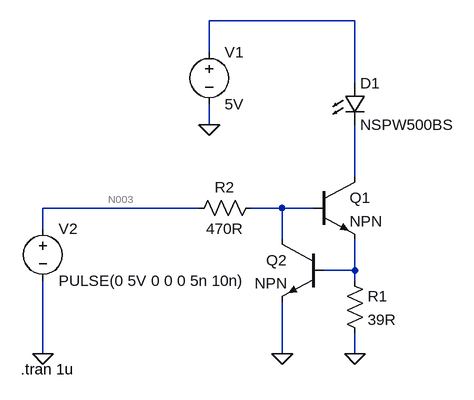
[diagram p0: schematic modulated_current_source.asc]
modulated_current_source.asc, the LTspice schematic file:
Version 4
SHEET 1 880 680
WIRE 368 -208 144 -208
WIRE 144 -160 144 -208
WIRE 368 -112 368 -208
WIRE 144 -48 144 -80
WIRE 368 32 368 -48
WIRE 128 80 -112 80
WIRE 256 80 208 80
WIRE 304 80 256 80
WIRE -112 112 -112 80
WIRE 256 128 256 80
WIRE 368 176 368 128
WIRE 368 176 320 176
WIRE 368 192 368 176
WIRE -112 304 -112 192
WIRE 256 304 256 224
WIRE 368 304 368 272
FLAG 368 304 0
FLAG 256 304 0
FLAG -112 304 0
FLAG 144 -48 0
SYMBOL npn 304 32 R0
SYMATTR InstName Q1
SYMBOL npn 320 128 M0
SYMATTR InstName Q2
SYMBOL res 352 176 R0
SYMATTR InstName R1
SYMATTR Value 39R
SYMBOL LED 352 -112 R0
SYMATTR InstName D1
SYMATTR Value NSPW500BS
SYMBOL voltage 144 -176 R0
WINDOW 123 0 0 Left 2
WINDOW 39 0 0 Left 2
SYMATTR InstName V1
SYMATTR Value 5V
SYMBOL voltage -112 96 R0
WINDOW 123 0 0 Left 2
WINDOW 39 0 0 Left 2
SYMATTR InstName V2
SYMATTR Value PULSE(0 5V 0 0 0 5n 10n)
SYMBOL res 112 96 R270
WINDOW 0 32 56 VTop 2
WINDOW 3 0 56 VBottom 2
SYMATTR InstName R2
SYMATTR Value 470R
TEXT -146 328 Left 2 !.tran 1u

The netlist it stands for:
* modulated_current_source.asc
Q1 N002 N004 N005 0 NPN
Q2 N004 N005 0 0 NPN
R1 N005 0 39R
D1 N001 N002 NSPW500BS
V1 N001 0 5V
V2 N003 0 PULSE(0 5V 0 0 0 5n 10n)
R2 N003 N004 470R
.model D D
.lib standard.dio
.model NPN NPN
.model PNP PNP
.lib standard.bjt
.tran 1u
.backanno
.end

* Results of the author's LTspice run, read from the files saved beside the schematic
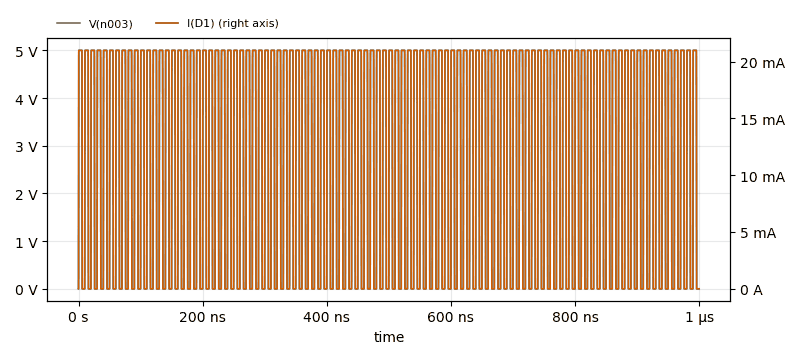
[diagram p1: Transient Analysis of modulated_current_source.asc, plotted from the saved traces]
* Transient Analysis, 1 run:
*   V(n003): min 0 V, max 5 V, average 2.75 V, rms 3.656 V, last 0 V
*   I(D1): min 0 A, max 20.99 mA, average 12.01 mA, rms 15.77 mA, last 0 A